# EAGLE schematic Conexion (EAGLE 9.7.0)
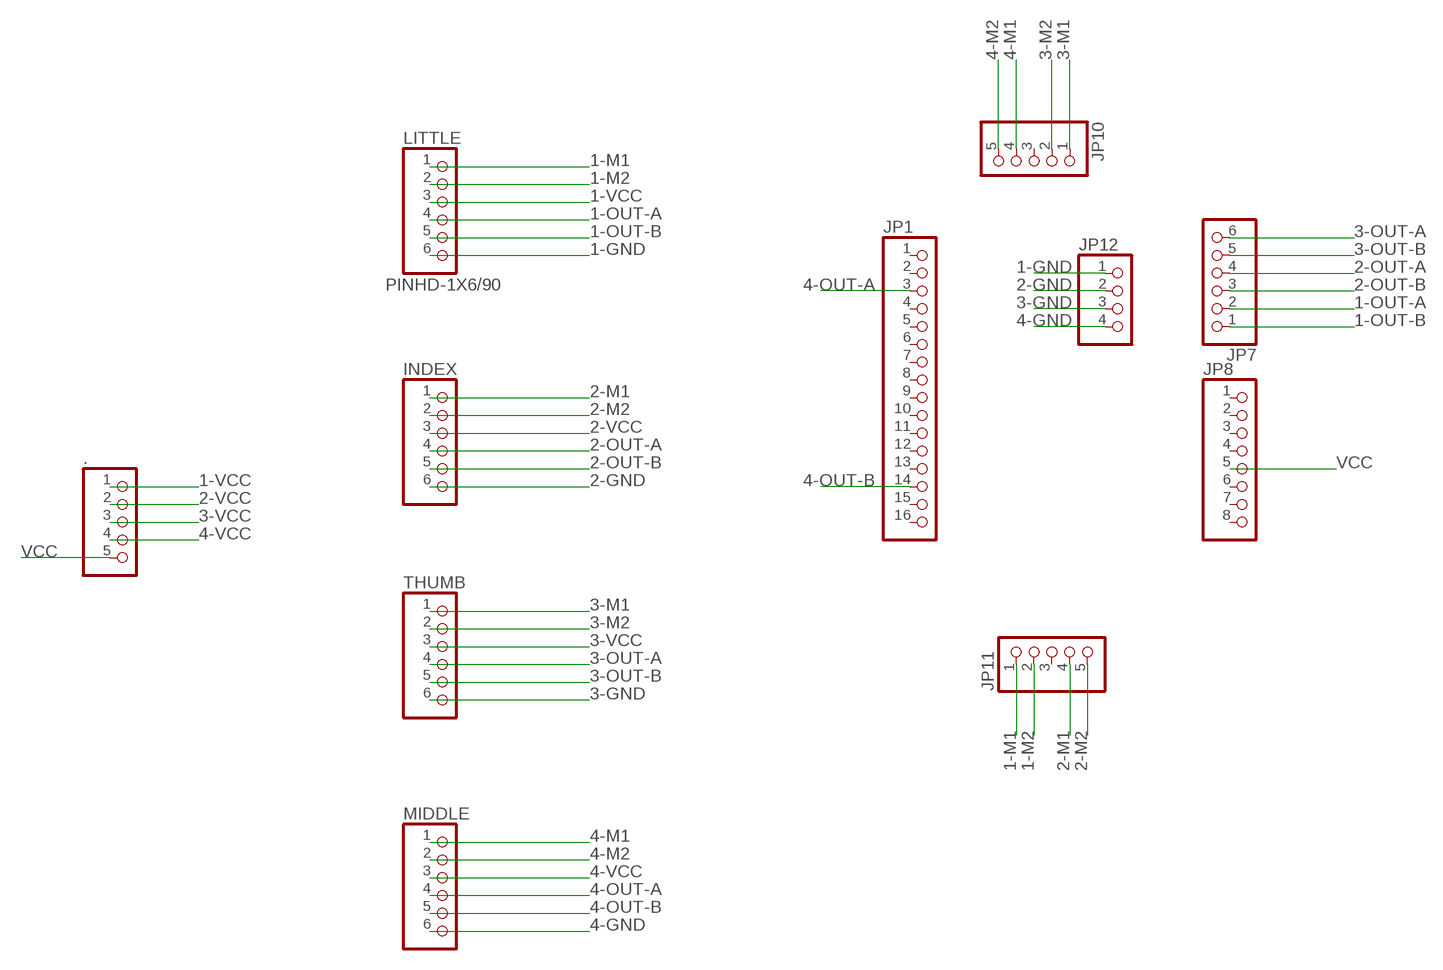
[diagram p0: schematic, sheet 1]

## Parts
.  PINHD-1X55X2MM  [1_05X2MM]
INDEX  PINHD-1X6/90  [1X06/90]
JP1  PINHD-1X16/90  [1X16/90]
JP7  PINHD-1X6/90  [1X06/90]
JP8  PINHD-1X8/90  [1X08/90]
JP10  PINHD-1X55X2MM  [1_05X2MM]
JP11  PINHD-1X55X2MM  [1_05X2MM]
JP12  PINHD-1X4/90  [1X04/90]
LITTLE  PINHD-1X6/90  [1X06/90]
MIDDLE  PINHD-1X6/90  [1X06/90]
THUMB  PINHD-1X6/90  [1X06/90]

## Nets
1-GND: JP12.1 LITTLE.6
1-M1: JP11.1 LITTLE.1
1-M2: JP11.2 LITTLE.2
1-OUT-A: JP7.2 LITTLE.4
1-OUT-B: JP7.1 LITTLE.5
1-VCC: ..1 LITTLE.3
2-GND: INDEX.6 JP12.2
2-M1: INDEX.1 JP11.4
2-M2: INDEX.2 JP11.5
2-OUT-A: INDEX.4 JP7.4
2-OUT-B: INDEX.5 JP7.3
2-VCC: ..2 INDEX.3
3-GND: JP12.3 THUMB.6
3-M1: JP10.1 THUMB.1
3-M2: JP10.2 THUMB.2
3-OUT-A: JP7.6 THUMB.4
3-OUT-B: JP7.5 THUMB.5
3-VCC: ..3 THUMB.3
4-GND: JP12.4 MIDDLE.6
4-M1: JP10.4 MIDDLE.1
4-M2: JP10.5 MIDDLE.2
4-OUT-A: JP1.3 MIDDLE.4
4-OUT-B: JP1.14 MIDDLE.5
4-VCC: ..4 MIDDLE.3
VCC: ..5 JP8.5
Unconnected: JP1.1 JP1.2 JP1.4 JP1.5 JP1.6 JP1.7 JP1.8 JP1.9 JP1.10 JP1.11 JP1.12 JP1.13 JP1.15 JP1.16 JP8.1 JP8.2 JP8.3 JP8.4 JP8.6 JP8.7 JP8.8 JP10.3 JP11.3

## Library data of the parts
. JP10 JP11 = Connector:PINHD-1X5: PIN HEADER; CATEGORY: CONNECTOR; SUB-CATEGORY: PIN-HEADER
INDEX JP7 LITTLE MIDDLE THUMB = Connector:PINHD-1X6: PIN HEADER; CATEGORY: CONNECTOR; SUB-CATEGORY: PIN-HEADER
JP1 = Connector:PINHD-1X16: PIN HEADER; CATEGORY: CONNECTOR; SUB-CATEGORY: PIN-HEADER
JP8 = Connector:PINHD-1X8: PIN HEADER; CATEGORY: CONNECTOR; SUB-CATEGORY: PIN-HEADER
JP12 = Connector:PINHD-1X4: PIN HEADER; CATEGORY: CONNECTOR; SUB-CATEGORY: PIN-HEADER